# Altium schematic sheet Accelerometer.SchDoc
size 209 x 297 mm; SheetNumber: 3; SheetTotal: 3
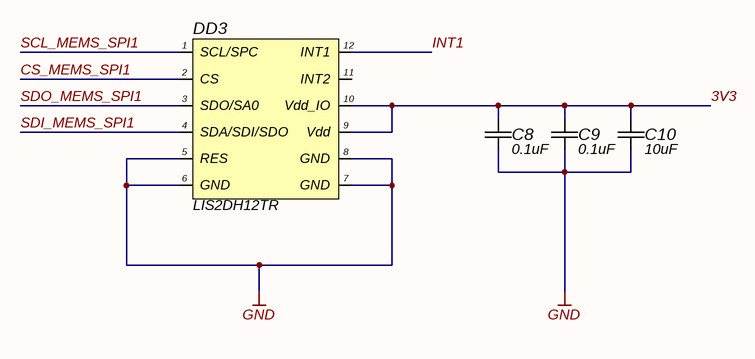
[diagram p0: Accelerometer.SchDoc]

## Parts
C8  value 0.1uF  [CAP: 0603]
C9  value 0.1uF  [CAP: 0603]
C10  value 10uF  [CAP: 0603]
DD3  LIS2DH12TR  [12-LGA]

## Nets
GND: C8.1 C9.1 C10.1 DD3.5(RES) DD3.6(GND) DD3.7(GND) DD3.8(GND)
3V3: C8.2 C9.2 C10.2 DD3.9(Vdd) DD3.10(Vdd_IO)
CS_MEMS_SPI1: DD3.2(CS)
INT1: DD3.12(INT1)
SCL_MEMS_SPI1: DD3.1(SCL/SPC)
SDI_MEMS_SPI1: DD3.4(SDA/SDI/SDO)
SDO_MEMS_SPI1: DD3.3(SDO/SA0)

Not connected (* = marked no-connect by the designer): DD3 11(INT2)

## Notes on the sheet
- Подп. и дата
- Инв. № дубл.
- Взам. инв. №
- Инв. № подл.
- Изм.
- Лист
- № докум.
- Подп.
- Дата
- Форма 2а ГОСТ 2.104-2006
- Копировал
- Формат А4

## Library data of the parts
C8 C9 = Ceramic_0603: Manufacturer: Yageo; PartNumber: CC0603KRX7R7BB104; ValueManufacturerPartNumber: Ceramic capacitor, 0.1uF, X7R, ±10%, 16V, 0603, -55...+125°C; TypeCapacitor: Ceramic capacitor; Tolerance: ±10%; TypeDielectric: X7R; Voltage: 16V; Package: 0603; HelpURL: https://www.digikey.com/product-detail/en/yageo/CC0603KRX7R7BB104/311-1088-1-ND/302998; Temperature: -55...+125°C
C10 = Ceramic_0603: Manufacturer: Yageo; PartNumber: CC0603KRX7R7BB104; ValueManufacturerPartNumber: Ceramic capacitor, 10uF, X7R, ±10%, 16V, 0603, -55...+125°C; TypeCapacitor: Ceramic capacitor; Tolerance: ±10%; TypeDielectric: X7R; Voltage: 16V; Package: 0603; HelpURL: https://www.digikey.com/product-detail/en/yageo/CC0603KRX7R7BB104/311-1088-1-ND/302998; Temperature: -55...+125°C
DD3 = LIS2DH12TR: MEMS accelerometer; ComponentLink1Description: Datasheet; ComponentLink1URL: https://estore.st.com/en/lis2dh12tr-cpn.html